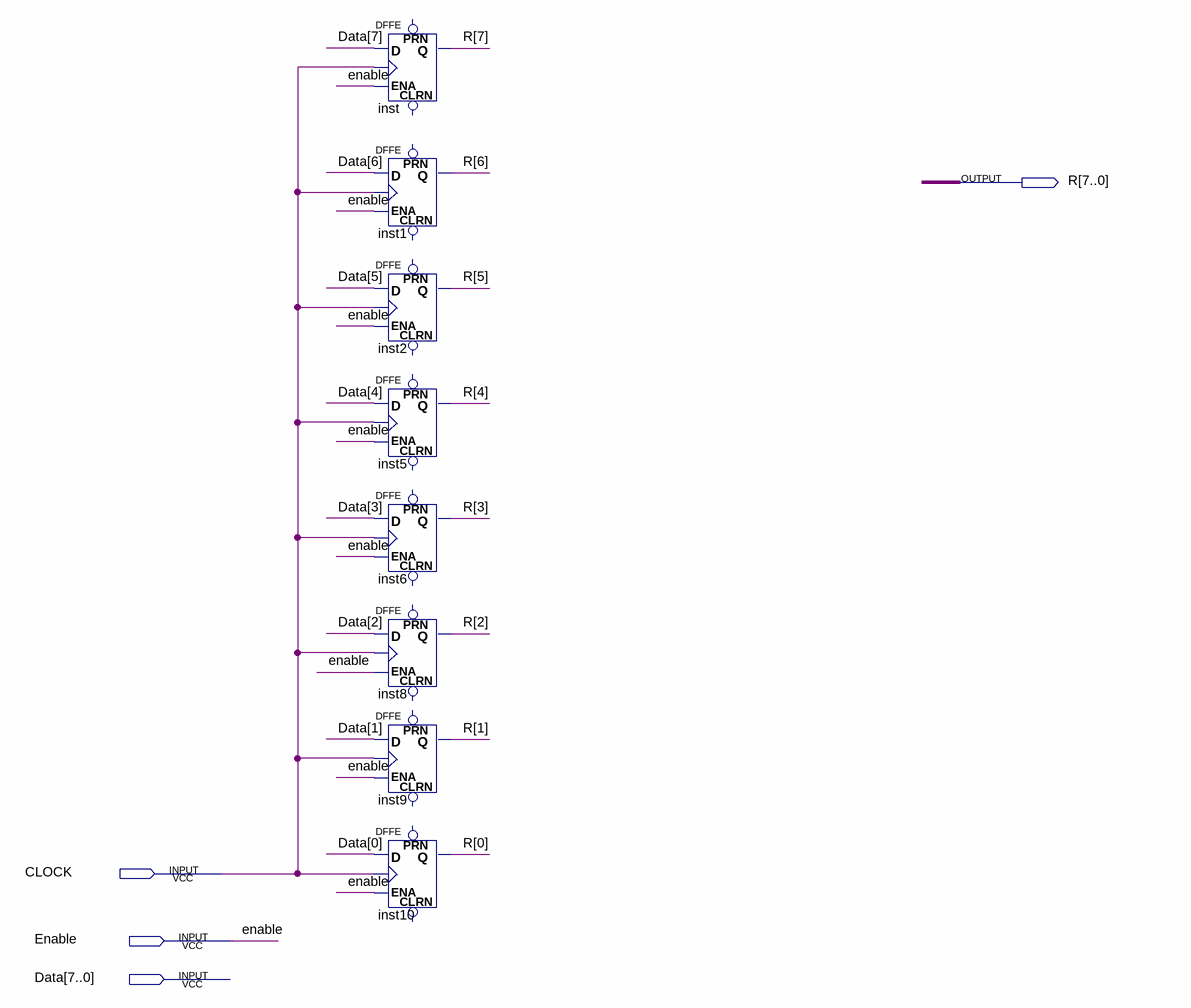
[diagram p0: schematic sheet]
// Quartus schematic ByteRegister2.bdf as structural Verilog: 8 symbols, 4 pins
module ByteRegister2 (
  input  CLOCK,
  input  Enable,
  input  [7:0] Data,
  output [7:0] R
);

  DFFE inst (.D(Data[7]), .CLK(CLOCK), .ENA(Enable), .Q(R[7]));  // open: PRN, CLRN
  DFFE inst1 (.D(Data[6]), .CLK(CLOCK), .ENA(Enable), .Q(R[6]));  // open: PRN, CLRN
  DFFE inst2 (.D(Data[5]), .CLK(CLOCK), .ENA(Enable), .Q(R[5]));  // open: PRN, CLRN
  DFFE inst5 (.D(Data[4]), .CLK(CLOCK), .ENA(Enable), .Q(R[4]));  // open: PRN, CLRN
  DFFE inst6 (.D(Data[3]), .CLK(CLOCK), .ENA(Enable), .Q(R[3]));  // open: PRN, CLRN
  DFFE inst8 (.D(Data[2]), .CLK(CLOCK), .ENA(Enable), .Q(R[2]));  // open: PRN, CLRN
  DFFE inst9 (.D(Data[1]), .CLK(CLOCK), .ENA(Enable), .Q(R[1]));  // open: PRN, CLRN
  DFFE inst10 (.D(Data[0]), .CLK(CLOCK), .ENA(Enable), .Q(R[0]));  // open: PRN, CLRN
endmodule
